# Altium schematic sheet Ethernet.SchDoc
size A4; SheetNumber: 2; SheetTotal: 2
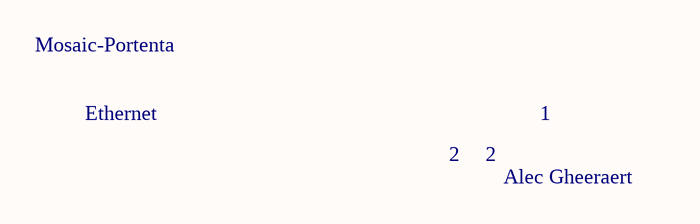
[diagram p0: Ethernet.SchDoc]

## Notes on the sheet
- Mosaic-Portenta
- Ethernet
- 2
- 1
- Alec Gheeraert